# EAGLE schematic ESP32 Display 4.3 inch V1.2 (EAGLE 9.5.1)
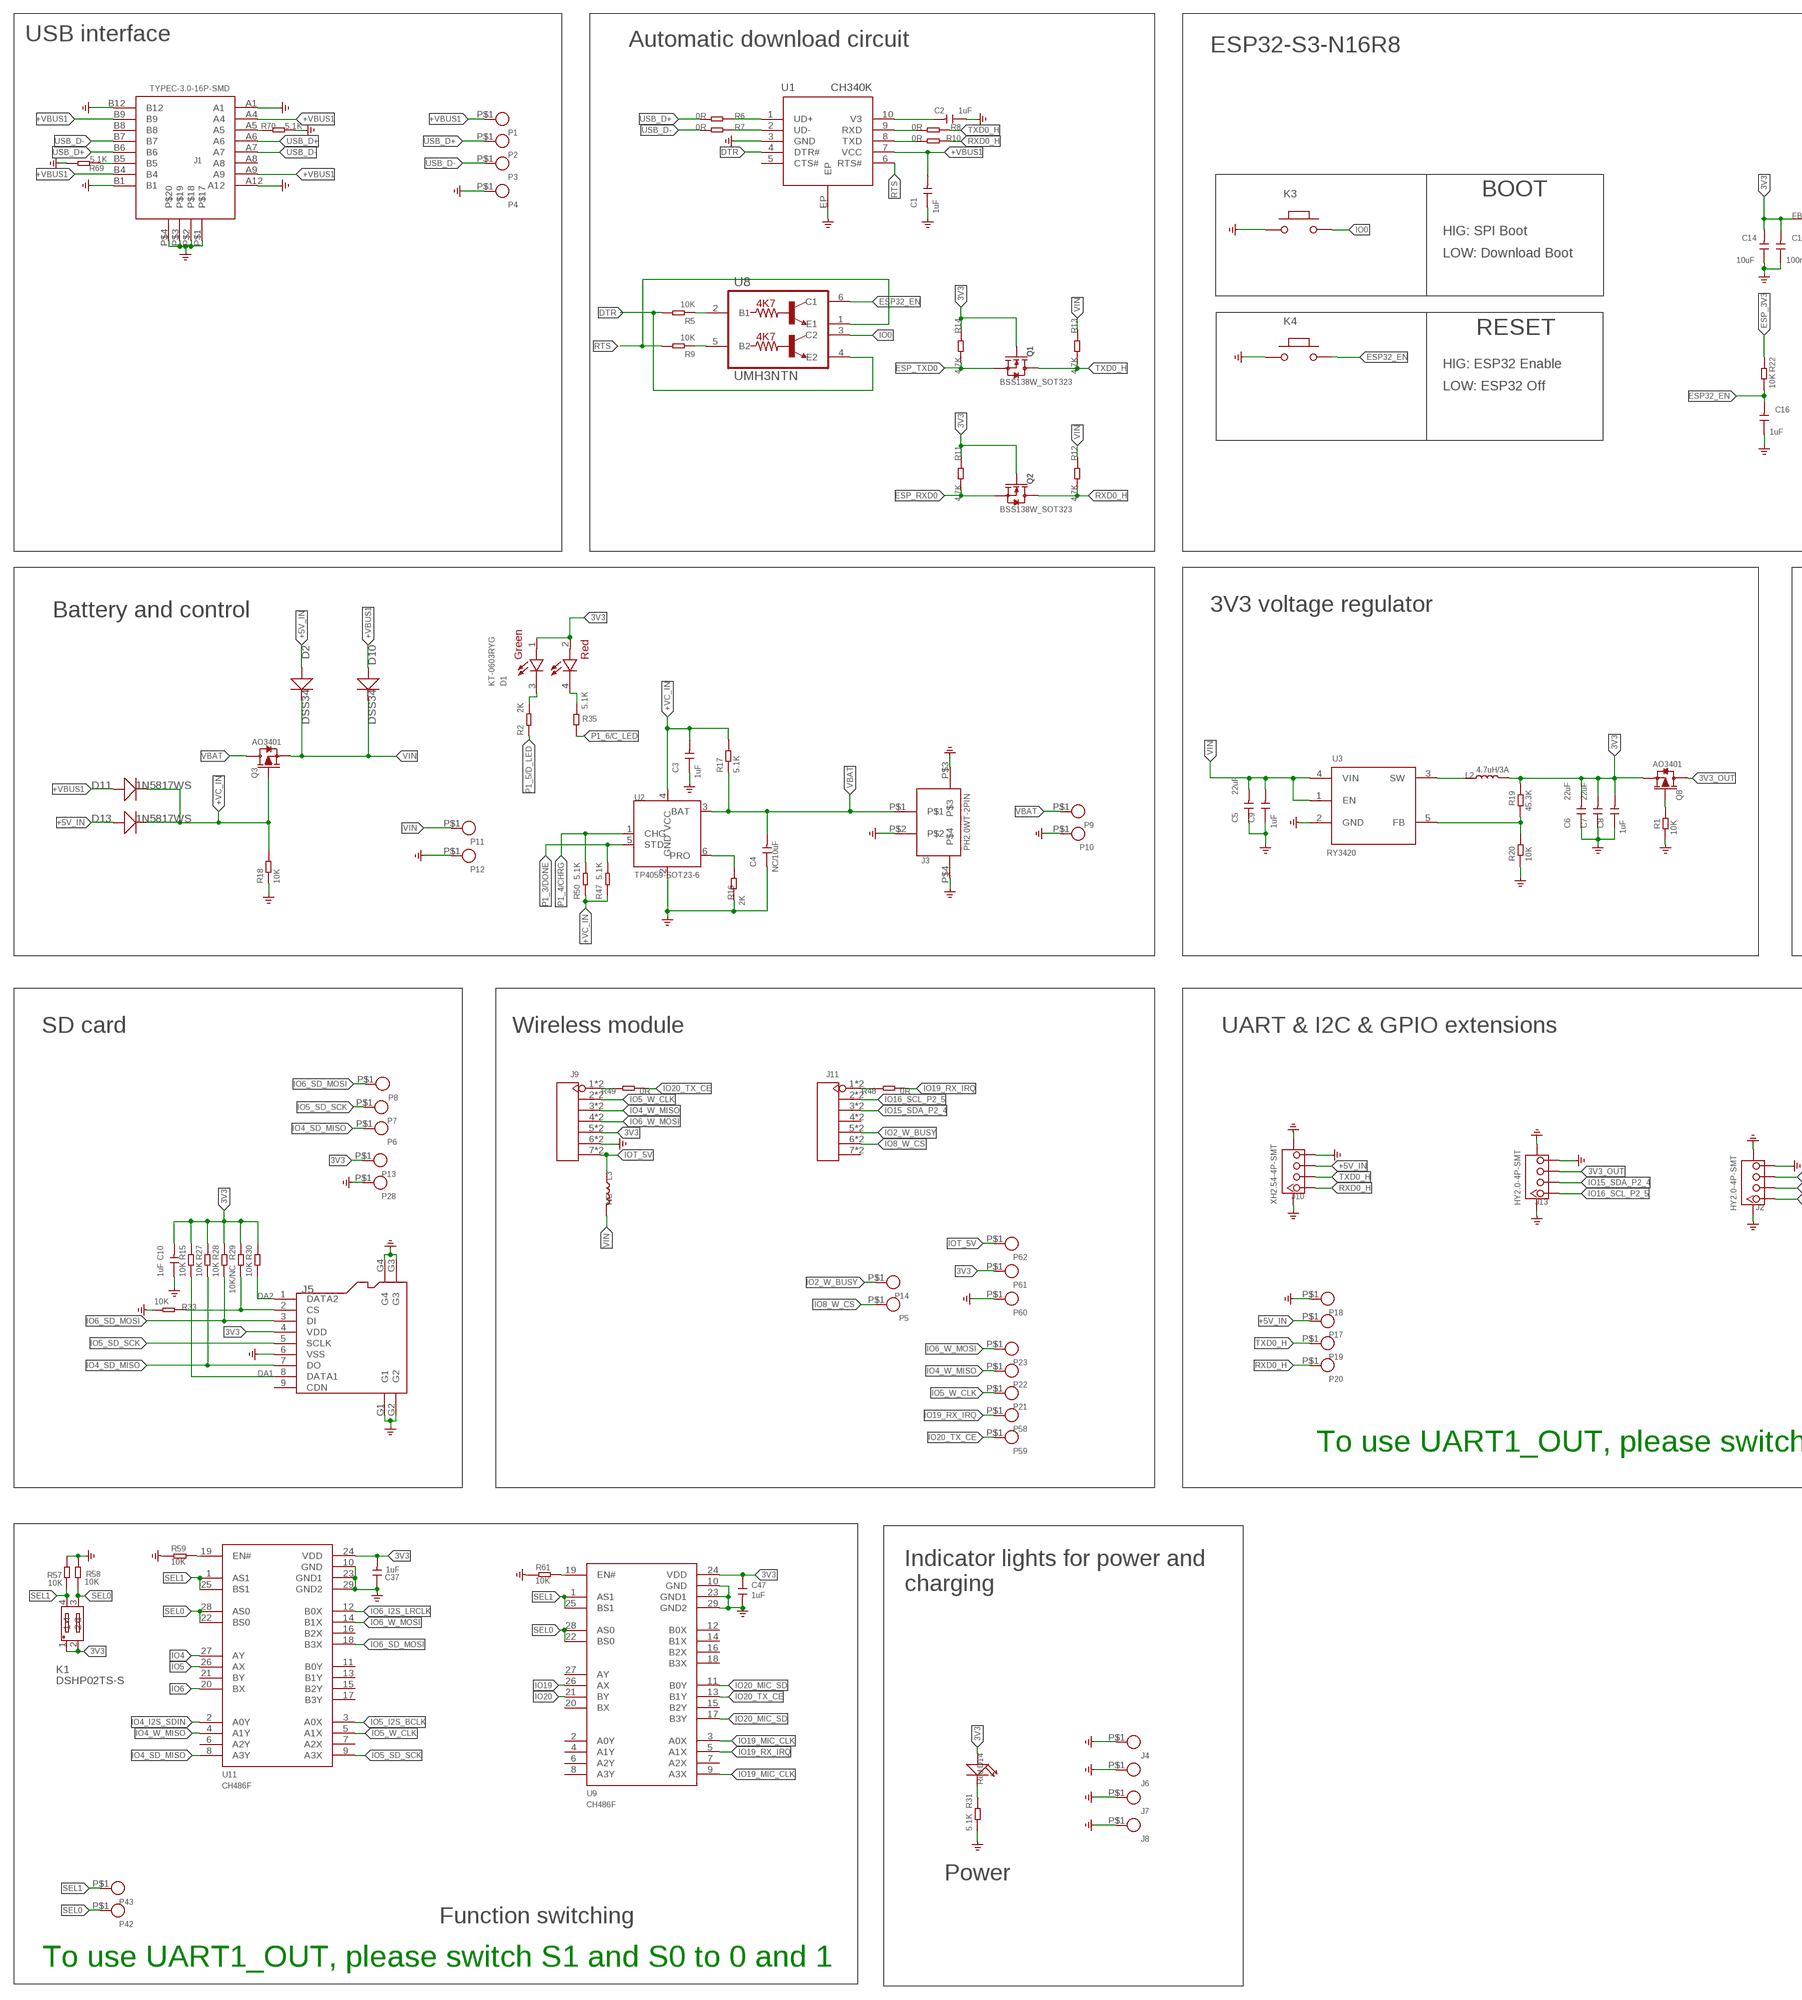
[diagram p0: schematic, sheet 1, part 1 of 2]
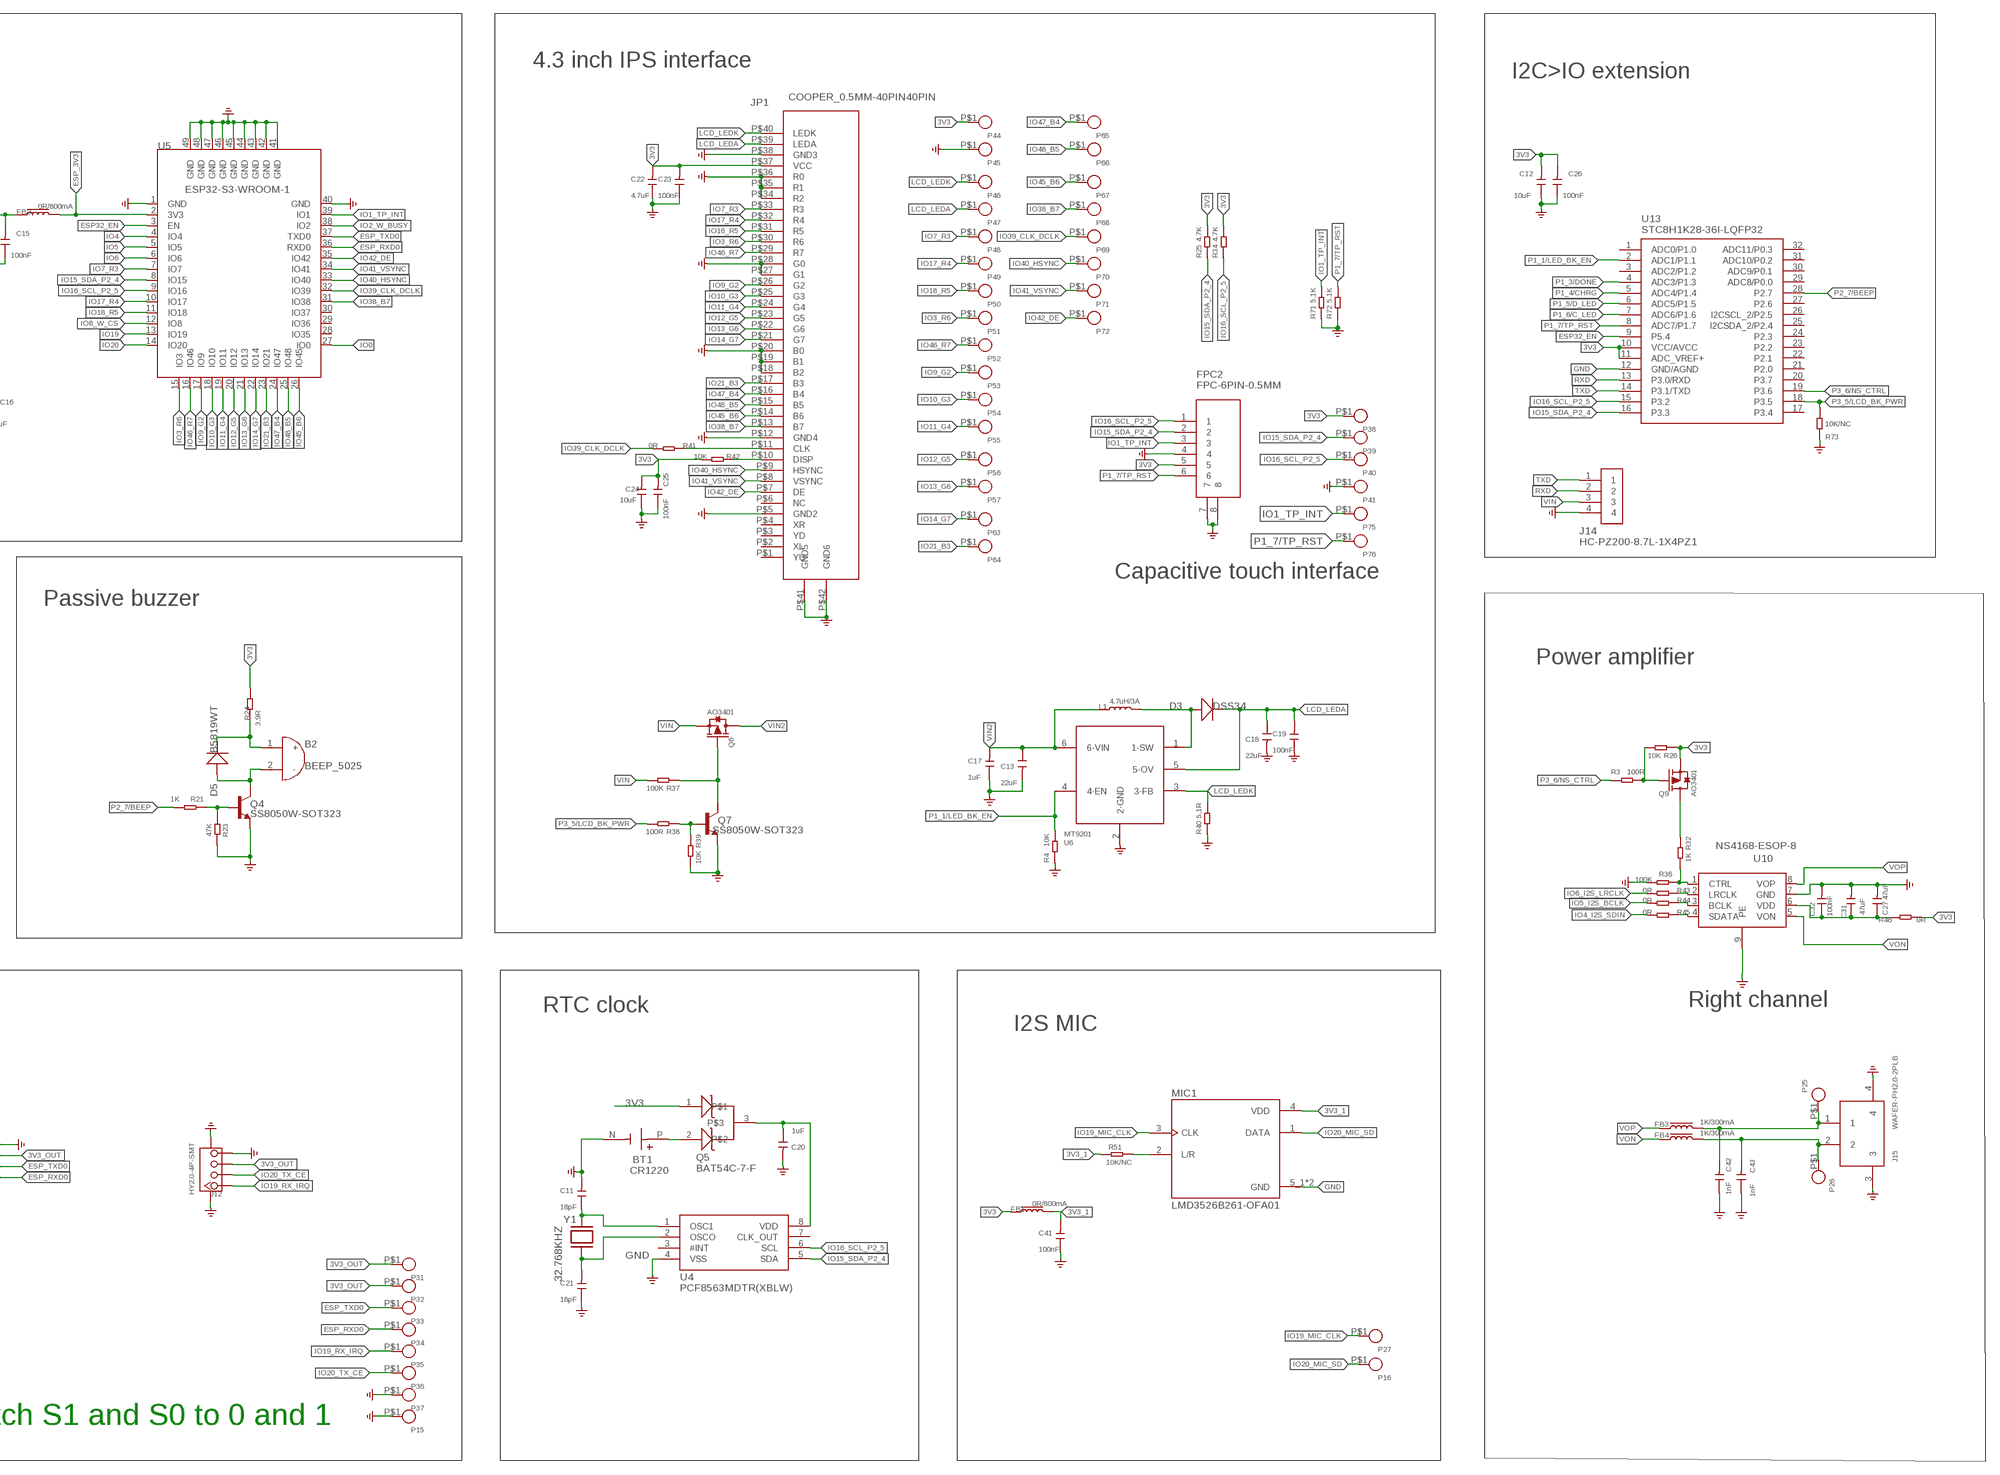
[diagram p1: schematic, sheet 1, part 2 of 2]

## Parts
B2  BEEP_5025  [BEEP_5025]
BT1  CR1220  [CR1220]
C1  1uF  CAP  [C0603]
C2  1uF  CAP  [C0603]
C3  1uF  CAP  [C0603]
C4  NC/10uF  CAP  [C0603]
C5  22uF  CAPC0805  [C0805]
C6  22uF  CAPC0805  [C0805]
C7  22uF  CAPC0805  [C0805]
C8  1uF  CAP  [C0603]
C9  1uF  CAP  [C0603]
C10  1uF  CAP  [C0603]
C11  18pF  CAP  [C0603]
C12  10uF  CAP  [C0603]
C13  22uF  CAPC0805  [C0805]
C14  10uF  CAP  [C0603]
C15  100nF  CAP  [C0603]
C16  1uF  CAP  [C0603]
C17  1uF  CAP  [C0603]
C18  22uF  CAPC0805  [C0805]
C19  100nF  CAP  [C0603]
C20  1uF  CAP  [C0603]
C21  18pF  CAP  [C0603]
C22  4.7uF  CAP  [C0603]
C23  100nF  CAP  [C0603]
C24  10uF  CAP  [C0603]
C25  100nF  CAP  [C0603]
C26  100nF  CAP  [C0603]
C27  47uF  CAPC0805  [C0805]
C31  47uF  CAPC0805  [C0805]
C32  100nF  CAP  [C0603]
C37  1uF  CAP  [C0603]
C41  100nF  CAP  [C0603]
C42  1nF  CAP  [C0603]
C43  1nF  CAP  [C0603]
C47  1uF  CAP  [C0603]
D1  KT-0603RYG  [LED_KT-0603RYG]
D2  DSS34  DIODE  [D_SOD123FL]
D3  DSS34  DIODE  [D_SOD123FL]
D5  B5819WT  DIODE0603  [D_SOD523]
D10  DSS34  DIODE  [D_SOD123FL]
D11  1N5817WS  DIODE0805  [D_SOD323]
D13  1N5817WS  DIODE0805  [D_SOD323]
D14  Red  LED-SMT0603  [LED0603]
FB1  0R/800mA  FBL0603  [L0603]
FB2  0R/800mA  FBL0603  [L0603]
FB3  1K/300mA  FBL0603  [L0603]
FB4  1K/300mA  FBL0603  [L0603]
FPC2  FPC-6PIN-0.5MM  [FPC-6PIN-0.5MM]
J1  TYPEC-3.0-16P-SMD  [USB-3.0TYPEC-SMD]
J2  HY2.0-4P-SMT  CONNECTOR_TWIG-4P-2.0-SMD-FEMALE-REINFORCEDD  [CONNECTOR_4P-SMD-2.0]
J3  PH2.0WT-2PIN  [PH2.0WT-2PIN]
J4  THO-M3.25MM-HOLE  [THO-M3.2*5MM-HOLE]
J5  HOLDER-MICROSD-9P  [9P-SMD-W/-RING]
J6  THO-M3.25MM-HOLE  [THO-M3.2*5MM-HOLE]
J7  THO-M3.25MM-HOLE  [THO-M3.2*5MM-HOLE]
J8  THO-M3.25MM-HOLE  [THO-M3.2*5MM-HOLE]
J9  HEADER-7P-18.28X2.5  [H7-2.54-18.28X2.5X5MM]
J10  XH2.54-4P-SMT  [XH2.54-4P-SMD]
J11  HEADER-7P-18.28X2.5  [H7-2.54-18.28X2.5X5MM]
J12  HY2.0-4P-SMT  CONNECTOR_TWIG-4P-2.0-SMD-FEMALE-REINFORCEDD  [CONNECTOR_4P-SMD-2.0]
J13  HY2.0-4P-SMT  CONNECTOR_TWIG-4P-2.0-SMD-FEMALE-REINFORCEDD  [CONNECTOR_4P-SMD-2.0]
J14  HC-PZ200-8.7L-1X4PZ1  [TEST-PIN-4-2.0MM]
J15  WAFER-PH2.0-2PLB  [CONN-TH_2P-P2.00_XUNPU_WAFER-PH2.0-2PLB]
JP1  COOPER_0.5MM-40PIN40PIN  [COOPER_0.5MM*40P]
K1  DSHP02TS-S  [SW-SMD_DSHP02TS-S_1]
K3  BUTTON  PB157  [157SW]
K4  BUTTON  PB157  [157SW]
L1  4.7uH/3A  LL0420  [L0420]
L2  4.7uH/3A  LL0420  [L0420]
L3  NC  L0603  [L0603]
MIC1  LMD3526B261-OFA01  LMD3526B261-OFA03  [MIC-SMD_5P-L3.5-W2.7-P1.67]
P1  TEST_PADPAD-1.5MM  [TEST_PAD-1.5MM]
P2  TEST_PADPAD-1.5MM  [TEST_PAD-1.5MM]
P3  TEST_PADPAD-1.5MM  [TEST_PAD-1.5MM]
P4  TEST_PADPAD-1.5MM  [TEST_PAD-1.5MM]
P5  TEST_PADPAD-1.5MM  [TEST_PAD-1.5MM]
P6  TEST_PADPAD-1.5MM  [TEST_PAD-1.5MM]
P7  TEST_PADPAD-1.5MM  [TEST_PAD-1.5MM]
P8  TEST_PADPAD-1.5MM  [TEST_PAD-1.5MM]
P9  TEST_PADPAD-1.5MM  [TEST_PAD-1.5MM]
P10  TEST_PADPAD-1.5MM  [TEST_PAD-1.5MM]
P11  TEST_PADPAD-1.5MM  [TEST_PAD-1.5MM]
P12  TEST_PADPAD-1.5MM  [TEST_PAD-1.5MM]
P13  TEST_PADPAD-1.5MM  [TEST_PAD-1.5MM]
P14  TEST_PADPAD-1.5MM  [TEST_PAD-1.5MM]
P15  TEST_PADPAD-1.5MM  [TEST_PAD-1.5MM]
P16  TEST_PADPAD-1.5MM  [TEST_PAD-1.5MM]
P17  TEST_PADPAD-1.5MM  [TEST_PAD-1.5MM]
P18  TEST_PADPAD-1.5MM  [TEST_PAD-1.5MM]
P19  TEST_PADPAD-1.5MM  [TEST_PAD-1.5MM]
P20  TEST_PADPAD-1.5MM  [TEST_PAD-1.5MM]
P21  TEST_PADPAD-1.5MM  [TEST_PAD-1.5MM]
P22  TEST_PADPAD-1.5MM  [TEST_PAD-1.5MM]
P23  TEST_PADPAD-1.5MM  [TEST_PAD-1.5MM]
P25  TEST_PADPAD-1.5MM  [TEST_PAD-1.5MM]
P26  TEST_PADPAD-1.5MM  [TEST_PAD-1.5MM]
P27  TEST_PADPAD-1.5MM  [TEST_PAD-1.5MM]
P28  TEST_PADPAD-1.5MM  [TEST_PAD-1.5MM]
P31  TEST_PADPAD-1.5MM  [TEST_PAD-1.5MM]
P32  TEST_PADPAD-1.5MM  [TEST_PAD-1.5MM]
P33  TEST_PADPAD-1.5MM  [TEST_PAD-1.5MM]
P34  TEST_PADPAD-1.5MM  [TEST_PAD-1.5MM]
P35  TEST_PADPAD-1.5MM  [TEST_PAD-1.5MM]
P36  TEST_PADPAD-1.5MM  [TEST_PAD-1.5MM]
P37  TEST_PADPAD-1.5MM  [TEST_PAD-1.5MM]
P38  TEST_PADPAD-1.5MM  [TEST_PAD-1.5MM]
P39  TEST_PADPAD-1.5MM  [TEST_PAD-1.5MM]
P40  TEST_PADPAD-1.5MM  [TEST_PAD-1.5MM]
P41  TEST_PADPAD-1.5MM  [TEST_PAD-1.5MM]
P42  TEST_PADPAD-1.5MM  [TEST_PAD-1.5MM]
P43  TEST_PADPAD-1.5MM  [TEST_PAD-1.5MM]
P44  TEST_PADPAD-1.5MM  [TEST_PAD-1.5MM]
P45  TEST_PADPAD-1.5MM  [TEST_PAD-1.5MM]
P46  TEST_PADPAD-1.5MM  [TEST_PAD-1.5MM]
P47  TEST_PADPAD-1.5MM  [TEST_PAD-1.5MM]
P48  TEST_PADPAD-1.5MM  [TEST_PAD-1.5MM]
P49  TEST_PADPAD-1.5MM  [TEST_PAD-1.5MM]
P50  TEST_PADPAD-1.5MM  [TEST_PAD-1.5MM]
P51  TEST_PADPAD-1.5MM  [TEST_PAD-1.5MM]
P52  TEST_PADPAD-1.5MM  [TEST_PAD-1.5MM]
P53  TEST_PADPAD-1.5MM  [TEST_PAD-1.5MM]
P54  TEST_PADPAD-1.5MM  [TEST_PAD-1.5MM]
P55  TEST_PADPAD-1.5MM  [TEST_PAD-1.5MM]
P56  TEST_PADPAD-1.5MM  [TEST_PAD-1.5MM]
P57  TEST_PADPAD-1.5MM  [TEST_PAD-1.5MM]
P58  TEST_PADPAD-1.5MM  [TEST_PAD-1.5MM]
P59  TEST_PADPAD-1.5MM  [TEST_PAD-1.5MM]
P60  TEST_PADPAD-1.5MM  [TEST_PAD-1.5MM]
P61  TEST_PADPAD-1.5MM  [TEST_PAD-1.5MM]
P62  TEST_PADPAD-1.5MM  [TEST_PAD-1.5MM]
P63  TEST_PADPAD-1.5MM  [TEST_PAD-1.5MM]
P64  TEST_PADPAD-1.5MM  [TEST_PAD-1.5MM]
P65  TEST_PADPAD-1.5MM  [TEST_PAD-1.5MM]
P66  TEST_PADPAD-1.5MM  [TEST_PAD-1.5MM]
P67  TEST_PADPAD-1.5MM  [TEST_PAD-1.5MM]
P68  TEST_PADPAD-1.5MM  [TEST_PAD-1.5MM]
P69  TEST_PADPAD-1.5MM  [TEST_PAD-1.5MM]
P70  TEST_PADPAD-1.5MM  [TEST_PAD-1.5MM]
P71  TEST_PADPAD-1.5MM  [TEST_PAD-1.5MM]
P72  TEST_PADPAD-1.5MM  [TEST_PAD-1.5MM]
P75  TEST_PADPAD-1.5MM  [TEST_PAD-1.5MM]
P76  TEST_PADPAD-1.5MM  [TEST_PAD-1.5MM]
Q1  BSS138W_SOT323  MOSFET-NSI1304BDL  [MOS_SOT323]
Q2  BSS138W_SOT323  MOSFET-NSI1304BDL  [MOS_SOT323]
Q3  AO3401  MOSFET-PSOT23  [PMOS_SOT23]
Q4  SS8050W-SOT323  TRANS_NPN  [MOS_SOT323]
Q5  BAT54C-7-F  [SOT-23]
Q6  AO3401  MOSFET-PSOT23  [PMOS_SOT23]
Q7  SS8050W-SOT323  TRANS_NPN  [MOS_SOT323]
Q8  AO3401  MOSFET-PSOT23  [PMOS_SOT23]
Q9  AO3401  MOSFET-PSOT23  [PMOS_SOT23]
R1  10K  RES-0603  [R0603-SP]
R2  2K  RES-0603  [R0603-SP]
R3  100R  RES-0603  [R0603-SP]
R4  10K  RES-0603  [R0603-SP]
R5  10K  RES-0603  [R0603-SP]
R6  0R  RES-0603  [R0603-SP]
R7  0R  RES-0603  [R0603-SP]
R8  0R  RES-0603  [R0603-SP]
R9  10K  RES-0603  [R0603-SP]
R10  0R  RES-0603  [R0603-SP]
R11  4.7K  RES-0603  [R0603-SP]
R12  4.7K  RES-0603  [R0603-SP]
R13  4.7K  RES-0603  [R0603-SP]
R14  4.7K  RES-0603  [R0603-SP]
R15  10K  RES-0603  [R0603-SP]
R16  2K  RES-0603  [R0603-SP]
R17  5.1K  RES-0603  [R0603-SP]
R18  10K  RES-0603  [R0603-SP]
R19  45.3K  RES-0603  [R0603-SP]
R20  10K  RES-0603  [R0603-SP]
R21  1K  RES-0603  [R0603-SP]
R22  10K  RES-0603  [R0603-SP]
R23  47K  RES-0603  [R0603-SP]
R24  3.9R  RES-0603  [R0603-SP]
R25  4.7K  RES-0603  [R0603-SP]
R26  10K  RES-0603  [R0603-SP]
R27  10K  RES-0603  [R0603-SP]
R28  10K  RES-0603  [R0603-SP]
R29  10K/NC  RES-0603  [R0603-SP]
R30  10K  RES-0603  [R0603-SP]
R31  5.1K  RES-0603  [R0603-SP]
R32  1K  RES-0603  [R0603-SP]
R33  10K  RES-0603  [R0603-SP]
R34  4.7K  RES-0603  [R0603-SP]
R35  5.1K  RES-0603  [R0603-SP]
R36  100K  RES-0603  [R0603-SP]
R37  100K  RES-0603  [R0603-SP]
R38  100R  RES-0603  [R0603-SP]
R39  10K  RES-0603  [R0603-SP]
R40  5.1R  RES-0603  [R0603-SP]
R41  0R  RES-0603  [R0603-SP]
R42  10K  RES-0603  [R0603-SP]
R43  0R  RES-0603  [R0603-SP]
R44  0R  RES-0603  [R0603-SP]
R45  0R  RES-0603  [R0603-SP]
R46  0R  RES-0603  [R0603-SP]
R47  5.1K  RES-0603  [R0603-SP]
R48  0R  RES-0603  [R0603-SP]
R49  0R  RES-0603  [R0603-SP]
R50  5.1K  RES-0603  [R0603-SP]
R51  10K/NC  RES-0603  [R0603-SP]
R57  10K  RES-0603  [R0603-SP]
R58  10K  RES-0603  [R0603-SP]
R59  10K  RES-0603  [R0603-SP]
R61  10K  RES-0603  [R0603-SP]
R69  5.1K  RES-0603  [R0603-SP]
R70  5.1K  RES-0603  [R0603-SP]
R71  5.1K  RES-0603  [R0603-SP]
R72  5.1K  RES-0603  [R0603-SP]
R73  10K/NC  RES-0603  [R0603-SP]
U1  CH340K  [ESOP-10-EP-150MIL]
U2  TP4059-SOT23-6  [SOT23-6L]
U3  RY3420  HM3416H  [IC_SOT23-5]
U4  PCF8563MDTR(XBLW)  BM8563EMA  [MSOP-8]
U5  ESP32-S3-WROOM-1  [ESP32-S3-WROOM-1-SMD41]
U6  MT9201  COOPER_MT9201  [COOPER_SOT23-6]
U8  UMH3NTN  [SOP65P210X100-6N]
U9  CH486F  [QFN-28_L4.0-W4.0-P0.40-BL-EP2.8]
U10  NS4168-ESOP-8  [NS4168-ESOP-8]
U11  CH486F  [QFN-28_L4.0-W4.0-P0.40-BL-EP2.8]
U13  STC8H1K28-36I-LQFP32  [QFP80P900X900X165-32N]
Y1  32.768KHZ  [SMD3215-2P]

## Nets
3V3: C6.2 C7.2 C8.2 C10.2 C12.2 C14.2 C15.2 C22.2 C23.2 C24.2 C25.2 C26.2 C37.2 C47.1 D1.1 D1.2 D14.+ FB1.1 FB2.1 FPC2.5 J5.4(VDD) J9.5 J9.5-5 JP1.P$37(VCC) K1.1 K1.2 L2.2 P13.P$1 P38.P$1 P44.P$1 P61.P$1 Q1.1(G) Q2.1(G) Q5.1 Q8.2(S) Q9.2(S) R11.1 R14.1 R15.2 R19.2 R24.2 R25.2 R26.1 R27.2 R28.2 R29.2 R30.2 R34.2 R42.2 R46.2 U9.24(VDD) U11.24(VDD) U13.10(VCC/AVCC) U13.11(ADC_VREF+)
3V3$: C2.2 U1.10(V3)
3V3_1: C41.2 FB1.2 MIC1.4(VDD) R51.2
3V3_NS_CTRL: Q9.3(D) R32.1
3V3_OUT: J2.3 J12.3 J13.3 P31.P$1 P32.P$1 Q8.3(D)
+5V_IN: D2.+ D13.+ J10.3 P17.P$1
+VBUS1: C1.2 D10.+ D11.+ J1.A4 J1.A9 J1.B4 J1.B9 P1.P$1 U1.7(VCC)
+VC_IN: C3.2 D11.- D13.- Q3.1(G) R17.2 R18.2 R47.2 R50.2 U2.4(VCC)
DA1: J5.8(DATA1) R15.1
DA2: J5.1(DATA2) R30.1
DTR: R5.2 U1.4(DTR#) U8.4(E2)
ESP32_EN: C16.2 K4.2 R22.2 U5.3(EN) U8.6(C1) U13.9(P5.4)
ESP_3V3: FB2.2 R22.1 U5.2(3V3)
ESP_RXD0: J2.1 P34.P$1 Q2.2(S) R11.2 U5.36(RXD0)
ESP_TXD0: J2.2 P33.P$1 Q1.2(S) R14.2 U5.37(TXD0)
GND: BT1.N(-) C1.1 C2.1 C3.1 C4.1 C5.1 C6.1 C7.1 C8.1 C9.1 C10.1 C11.2 C12.1 C13.2 C14.1 C15.1 C16.1 C17.1 C18.2 C19.1 C20.2 C21.1 C22.1 C23.1 C24.1 C25.1 C26.1 C27.2 C31.2 C32.2 C37.1 C41.1 C42.1 C43.1 C47.2 FPC2.4 FPC2.7 FPC2.8 J1.A1 J1.A12 J1.B1 J1.B12 J1.P$1 J1.P$2 J1.P$3 J1.P$4 J2.4 J2.SS1 J2.SS2 J3.P$2 J3.P$3 J3.P$4 J4.P$1 J5.6(VSS) J5.G1 J5.G2 J5.G3 J5.G4 J6.P$1 J7.P$1 J8.P$1 J9.6 J9.6-6 J10.4 J10.5(SS1) J10.6(SS2) J12.4 J12.SS1 J12.SS2 J13.4 J13.SS1 J13.SS2 J14.4 J15.3 J15.4 JP1.P$5(GND2) JP1.P$12(GND4) JP1.P$18(B2) JP1.P$19(B1) JP1.P$20(B0) JP1.P$27(G1) JP1.P$28(G0) JP1.P$34(R2) JP1.P$35(R1) JP1.P$36(R0) JP1.P$38(GND3) JP1.P$41(GND5) JP1.P$42(GND6) K3.1 K4.1 MIC1.5_1(GND) MIC1.5_2(GND) P4.P$1 P10.P$1 P12.P$1 P15.P$1 P18.P$1 P28.P$1 P37.P$1 P41.P$1 P45.P$1 P60.P$1 Q4.2(E) Q7.2(E) R1.1 R4.1 R16.1 R18.1 R20.1 R23.2 R31.1 R33.2 R36.2 R39.2 R40.1 R57.2 R58.2 R59.2 R61.2 R69.1 R70.2 R71.1 R72.1 R73.1 U1.3(GND) U1.EP U2.2(GND) U3.2(GND) U4.4(VSS) U5.1(GND) U5.40(GND) U5.41(GND) U5.42(GND) U5.43(GND) U5.44(GND) U5.45(GND) U5.46(GND) U5.47(GND) U5.48(GND) U5.49(GND) U6.2(2-GND) U9.10(GND) U9.23(GND1) U9.29(GND2) U10.7(GND) U10.9(PE) U11.10(GND) U11.23(GND1) U11.29(GND2) U13.12(GND/AGND)
IO0: K3.2 U5.27(IO0) U8.3(C2)
IO1_TP_INT: FPC2.3 P75.P$1 R71.2 U5.39(IO1)
IO2_W_BUSY: J11.5 J11.5-5 P14.P$1 U5.38(IO2)
IO3_R6: JP1.P$30(R6) P51.P$1 U5.15(IO3)
IO4: U5.4(IO4) U11.27(AY)
IO4_I2S_SDIN: R45.2 U11.2(A0Y)
IO4_SD_MISO: J5.7(DO) P6.P$1 R27.1 U11.8(A3Y)
IO4_W_MISO: J9.3 J9.3-3 P22.P$1 U11.4(A1Y)
IO5: U5.5(IO5) U11.26(AX)
IO5_I2S_BCLK: R44.2 U11.3(A0X)
IO5_SD_SCK: J5.5(SCLK) P7.P$1 U11.9(A3X)
IO5_W_CLK: J9.2 J9.2-2 P21.P$1 U11.5(A1X)
IO6: U5.6(IO6) U11.20(BX)
IO6_I2S_LRCLK: R43.2 U11.12(B0X)
IO6_SD_MOSI: J5.3(DI) P8.P$1 R28.1 U11.18(B3X)
IO6_W_MOSI: J9.4 J9.4-4 P23.P$1 U11.14(B1X)
IO7_R3: JP1.P$33(R3) P48.P$1 U5.7(IO7)
IO8_W_CS: J11.6 J11.6-6 P5.P$1 U5.12(IO8)
IO9_G2: JP1.P$26(G2) P53.P$1 U5.17(IO9)
IO10_G3: JP1.P$25(G3) P54.P$1 U5.18(IO10)
IO11_G4: JP1.P$24(G4) P55.P$1 U5.19(IO11)
IO12_G5: JP1.P$23(G5) P56.P$1 U5.20(IO12)
IO13_G6: JP1.P$22(G6) P57.P$1 U5.21(IO13)
IO14_G7: JP1.P$21(G7) P63.P$1 U5.22(IO14)
IO15_SDA_P2_4: FPC2.2 J11.3 J11.3-3 J13.2 P39.P$1 R25.1 U4.5(SDA) U5.8(IO15) U13.16(P3.3)
IO16_SCL_P2_5: FPC2.1 J11.2 J11.2-2 J13.1 P40.P$1 R34.1 U4.6(SCL) U5.9(IO16) U13.15(P3.2)
IO17_R4: JP1.P$32(R4) P49.P$1 U5.10(IO17)
IO18_R5: JP1.P$31(R5) P50.P$1 U5.11(IO18)
IO19: U5.13(IO19) U9.26(AX)
IO19_MIC_CLK: MIC1.3(CLK) P27.P$1 U9.3(A0X) U9.9(A3X)
IO19_RX_IRQ: J12.1 P35.P$1 P58.P$1 R48.2 U9.5(A1X)
IO20: U5.14(IO20) U9.21(BY)
IO20_MIC_SD: MIC1.1(DATA) P16.P$1 U9.11(B0Y) U9.17(B3Y)
IO20_TX_CE: J12.2 P36.P$1 P59.P$1 R49.2 U9.13(B1Y)
IO21_B3: JP1.P$17(B3) P64.P$1 U5.23(IO21)
IO38_B7: JP1.P$13(B7) P68.P$1 U5.31(IO38)
IO39_CLK_DCLK: P69.P$1 R41.2 U5.32(IO39)
IO40_HSYNC: JP1.P$9(HSYNC) P70.P$1 U5.33(IO40)
IO41_VSYNC: JP1.P$8(VSYNC) P71.P$1 U5.34(IO41)
IO42_DE: JP1.P$7(DE) P72.P$1 U5.35(IO42)
IO45_B6: JP1.P$14(B6) P67.P$1 U5.26(IO45)
IO46_R7: JP1.P$29(R7) P52.P$1 U5.16(IO46)
IO47_B4: JP1.P$16(B4) P65.P$1 U5.24(IO47)
IO48_B5: JP1.P$15(B5) P66.P$1 U5.25(IO48)
IOT_5V: J9.7 J9.7-7 L3.1 P62.P$1
LCD_LEDA: C18.1 C19.2 D3.- JP1.P$39(LEDA) P47.P$1 U6.5(5-OV)
LCD_LEDK: JP1.P$40(LEDK) P46.P$1 R40.2 U6.3(3-FB)
N$1: Q8.1(G) R1.2
N$2: D1.3 R2.1
N$3: D1.4 R35.1
N$4: D14.- R31.2
N$5: R6.1 U1.1(UD+)
N$6: R7.1 U1.2(UD-)
N$7: R5.1 U8.2(B1)
N$8: R9.1 U8.5(B2)
N$9: Q9.1(G) R3.2 R26.2
N$10: R8.2 U1.9(RXD)
N$11: R10.2 U1.8(TXD)
N$12: R16.2 U2.6(PRO)
N$13: L2.1 U3.3(SW)
N$14: R19.1 R20.2 U3.5(FB)
N$15: Q4.1(B) R21.1 R23.1
N$16: B2.2(-) D5.+ Q4.3(C)
N$17: B2.1(+) D5.- R24.1
N$18: BT1.P(+) Q5.2
N$19: R32.2 R36.1 U10.1(CTRL)
N$20: MIC1.2(L/R) R51.1
N$22: D3.+ L1.2 U6.1(1-SW)
N$23: J9.1 J9.1-1 R49.1
N$24: J11.1 J11.1-1 R48.1
N$25: C20.1 Q5.3 U4.8(VDD)
N$26: C21.2 U4.2(OSCO) Y1.2
N$28: R43.1 U10.2(LRCLK)
N$29: Q6.1(G) Q7.3(C) R37.1
N$30: C11.1 U4.1(OSC1) Y1.1
N$31: R44.1 U10.3(BCLK)
N$32: Q7.1(B) R38.1 R39.1
N$33: R45.1 U10.4(SDATA)
N$34: J1.B5 R69.2
N$35: R61.1 U9.19(EN#)
N$37: C27.1 C31.1 C32.1 R46.1 U10.6(VDD)
N$38: R59.1 U11.19(EN#)
N$40: J1.A5 R70.1
N$54: JP1.P$11(CLK) R41.1
N$55: JP1.P$10(DISP) R42.1
P1_1/LED_BK_EN: R4.2 U6.4(4-EN) U13.2(ADC1/P1.1)
P1_3/DONE: R47.1 U2.5(STD) U13.4(ADC3/P1.3)
P1_4/CHRG: R50.1 U2.1(CHG) U13.5(ADC4/P1.4)
P1_5/D_LED: R2.2 U13.6(ADC5/P1.5)
P1_6/C_LED: R35.2 U13.7(ADC6/P1.6)
P1_7/TP_RST: FPC2.6 P76.P$1 R72.2 U13.8(ADC7/P1.7)
P2_7/BEEP: R21.2 U13.28(P2.7)
P3_5/LCD_BK_PWR: R38.2 R73.2 U13.18(P3.5)
P3_6/NS_CTRL: R3.1 U13.19(P3.6)
ROUT+: C42.2 FB3.2 J15.1 P25.P$1
ROUT-: C43.2 FB4.2 J15.2 P26.P$1
RTS: R9.2 U1.6(RTS#) U8.1(E1)
RXD: J14.2 U13.13(P3.0/RXD)
RXD0_H: J10.1 P20.P$1 Q2.3(D) R10.1 R12.2
SDCS: J5.2(CS) R29.1 R33.1
SEL0: K1.3 P42.P$1 R58.1 U9.22(BS0) U9.28(AS0) U11.22(BS0) U11.28(AS0)
SEL1: K1.4 P43.P$1 R57.1 U9.1(AS1) U9.25(BS1) U11.1(AS1) U11.25(BS1)
TXD: J14.1 U13.14(P3.1/TXD)
TXD0_H: J10.2 P19.P$1 Q1.3(D) R8.1 R13.2
USB_D+: J1.A6 J1.B6 P2.P$1 R6.2
USB_D-: J1.A7 J1.B7 P3.P$1 R7.2
VBAT: C4.2 J3.P$1 P9.P$1 Q3.3(D) R17.1 U2.3(BAT)
VIN: C5.2 C9.2 D2.- D10.- J14.3 L3.2 P11.P$1 Q3.2(S) Q6.2(S) R12.1 R13.1 R37.2 U3.1(EN) U3.4(VIN)
VIN2: C13.1 C17.2 L1.1 Q6.3(D) U6.6(6-VIN)
VON: FB4.1 U10.5(VON)
VOP: FB3.1 U10.8(VOP)
Unconnected: J1.A8 J1.B8 J5.9(CDN) J11.4 J11.4-4 J11.7 J11.7-7 JP1.P$1(YU) JP1.P$2(XL) JP1.P$3(YD) JP1.P$4(XR) JP1.P$6(NC) U1.5(CTS#) U4.3(#INT) U4.7(CLK_OUT) U5.28(IO35) U5.29(IO36) U5.30(IO37) U9.2(A0Y) U9.4(A1Y) U9.6(A2Y) U9.7(A2X) U9.8(A3Y) U9.12(B0X) U9.14(B1X) U9.15(B2Y) U9.16(B2X) U9.18(B3X) U9.20(BX) U9.27(AY) U11.6(A2Y) U11.7(A2X) U11.11(B0Y) U11.13(B1Y) U11.15(B2Y) U11.16(B2X) U11.17(B3Y) U11.21(BY) U13.1(ADC0/P1.0) U13.3(ADC2/P1.2) U13.17(P3.4) U13.20(P3.7) U13.21(P2.0) U13.22(P2.1) U13.23(P2.2) U13.24(P2.3) U13.25(I2CSDA_2/P2.4) U13.26(I2CSCL_2/P2.5) U13.27(P2.6) U13.29(ADC8/P0.0) U13.30(ADC9/P0.1) U13.31(ADC10/P0.2) U13.32(ADC11/P0.3)

## Notes on the sheet
- USB interface | Automatic download circuit
- ESP32-S3-N16R8
- 4.3 inch IPS interface
- I2C>IO extension
- BOOT
- HIG: SPI Boot
- LOW: Download Boot
- RESET
- HIG: ESP32 Enable
- LOW: ESP32 Off
- Capacitive touch interface
- Battery and control | 3V3 voltage regulator | Passive buzzer
- Power amplifier
- RTC clock | Right channel
- SD card | Wireless module | UART & I2C & GPIO extensions
- I2S MIC
- To use UART1_OUT, please switch S1 and S0 to 0 and 1
- Indicator lights for power and 
  charging
- Power
- Function switching
- To use UART1_OUT, please switch S1 and S0 to 0 and 1

## Library data of the parts
B2 = CrowPanel_Advance_HMI:BEEP_5025
BT1 = CR1220:CR1220: Coin Cell Smt Horizontal Insul Check availability <https://pricing.snapeda.com/parts/S8411-45R/Harwin/view-part?ref=eda>; AVAILABILITY: In Stock; CHECK_PRICES: https://www.snapeda.com/parts/S8411-45R/Harwin+Inc./view-part/?ref=eda; DESCRIPTION: Coin Cell Battery Retainer, Horizontal SMT, for CR1220 Coin Cell Batteries, Tape & Reeled; MF: Harwin; MP: S8411-45R; PACKAGE: None; PRICE: None; PURCHASE-URL: https://www.snapeda.com/api/url_track_click_mouser/?unipart_id=424412&manufacturer=Harwin&part_name=S8411-45R&search_term=cr1220; SNAPEDA_LINK: https://www.snapeda.com/parts/S8411-45R/Harwin+Inc./view-part/?ref=snap
C1-C27 C31 C32 C37 C41-C43 C47 = CrowPanel_Advance_HMI:CAP*
D1 = KT-0603RYG:KT-0603RYG: Check availability <https://pricing.snapeda.com/parts/KT-0603R/Hubei%20KENTO%20Elec/view-part?ref=eda>
D2 D3 D5 D10 D11 D13 = CrowPanel_Advance_HMI:DIODE*
D14 = CrowPanel_Advance_HMI:LED-SMT*
FB1-FB4 = CrowPanel_Advance_HMI:FB*
FPC2 = CrowPanel_Advance_HMI:FPC-6PIN-0.5MM
J1 = CrowPanel_Advance_HMI:TYPEC-3.0-16P-SMD
J2 J12 J13 = CrowPanel_Advance_HMI:CONNECTOR_TWIG-4P-2.0-SMD-FEMALE-REINFORCE
J3 = CrowPanel_Advance_HMI:PH2.0WT-2PIN
J4 J6-J8 = CrowPanel_Advance_HMI:THO-M3.2*5MM-HOLE
J5 = CrowPanel_Advance_HMI:HOLDER-MICROSD-9P
J9 J11 = CrowPanel_Advance_HMI:HEADER-7P
J10 = CrowPanel_Advance_HMI:XH2.54-4P-SMT
J14 = Mini PC Case:HC-PZ200-8.7L-1X4PZ
J15 = CrowPanel_Advance_HMI:WAFER-PH2.0-2PLB
JP1 = CrowPanel_Advice_HMI 4.3:COOPER_0.5MM-40PIN
K1 = CrowPanel_Advance_HMI:DSHP02TS-S
K3 K4 = MySMD:PB157
L1-L3 = CrowPanel_Advance_HMI:L*
MIC1 = MMICT5838-00-012:LMD3526B261-OFA03
P1-P23 P25-P28 P31-P72 P75 P76 = CrowPanel_Advance_HMI:TEST_PAD*
Q1 Q2 = CrowPanel_Advance_HMI:MOSFET-N*: IRLL014: http://www.vishay.com/docs/91319/sihll014.pdf
Q3 Q6 Q8 Q9 = CrowPanel_Advance_HMI:MOSFET-P: IRLL014: http://www.vishay.com/docs/91319/sihll014.pdf
Q4 Q7 = CrowPanel_Advance_HMI:TRANS_NPN: NPN transistor Current controlled devices typically used to amplify current or used as a switch. BC547 - COM-08928 <http://www.sparkfun.com/products/8928> (TO-92 45V 100mA) (1.Collector 2.Base 3.Emitter) 2N3904 - COM-00521 <http://www.sparkfun.com/products/521> (TO-92 40V 200mA) (1.Emitter 2.Base 3.Collector) P2N2222A - COM-12852 <http://www.sparkfun.com/products/12852> (TO-92 40V 600mA) (1.Collector 2.Base 3.Emitter)
Q5 = BAT54C-7-F:BAT54C-7-F
R1-R51 R57-R59 R61 R69-R73 = CrowPanel_Advance_HMI:RES*
U1 = sale:CH340K
U2 = CrowPanel_Advance_HMI:TP4059-SOT23-6
U3 = CrowPanel_Advance_HMI:HM3416H
U4 = BM8563:BM8563EMA
U5 = CrowPanel_Advance_HMI:ESP32-S3-WROOM-1
U6 = CrowPanel_Advice_HMI 4.3:COOPER_MT9201
U8 = UMH3NTN:UMH3NTN: Dual NPN BJT with 4.7K Base resistor Datasheet <https://fscdn.rohm.com/en/products/databook/datasheet/discrete/transistor/digital/umh3ntn-e.pdf> BUY NOW <https://www.digikey.ca/en/products/detail/rohm-semiconductor/umh3ntn/659279> Check availability <https://pricing.snapeda.com/parts/UMH3NTN/Rohm/view-part?ref=eda>; AVAILABILITY: In Stock; CHECK_PRICES: https://www.snapeda.com/parts/UMH3NTN/Rohm/view-part/?ref=eda; DESCRIPTION: Pre-Biased Bipolar Transistor (BJT) 2 NPN - Pre-Biased (Dual) 50V 100mA 250MHz 150mW Surface Mount UMT6; MF: Rohm; MP: UMH3NTN; PACKAGE: SOT-363 Rohm; PRICE: None; PURCHASE-URL: https://www.snapeda.com/api/url_track_click_mouser/?unipart_id=355768&manufacturer=Rohm&part_name=UMH3NTN&search_term=umh3n; SNAPEDA_LINK: https://www.snapeda.com/parts/UMH3NTN/Rohm/view-part/?ref=snap
U9 U11 = CH48X:CH486F
U10 = STC_MCUSTC8G1K08A:NS4168-ESOP-8
U13 = Brian:STC8H1K28-36I-LQFP32
Y1 = Crystal:32.768KHZ: Check availability <https://pricing.snapeda.com/parts/CM7V-T1A-32.768kHz-12.5pF-100PPM-TB-QC/Micro%20Crystal/view-part?ref=eda>; AVAILABILITY: In Stock; CHECK_PRICES: https://www.snapeda.com/parts/CM7V-T1A-32.768kHz-12.5pF-100PPM-TB-QC/Micro+Crystal/view-part/?ref=eda; DESCRIPTION: Tuning Fork Crystal 32.768kHz in SMD 1.5 x 3.2 mm package; MF: Micro Crystal; MP: CM7V-T1A-32.768kHz-12.5pF-100PPM-TB-QC; PACKAGE: SMD-2 Micro Crystal; PRICE: None; PURCHASE-URL: https://www.snapeda.com/api/url_track_click_mouser/?unipart_id=4216772&manufacturer=Micro Crystal&part_name=CM7V-T1A-32.768kHz-12.5pF-100PPM-TB-QC&search_term=crystal; SNAPEDA_LINK: https://www.snapeda.com/parts/CM7V-T1A-32.768kHz-12.5pF-100PPM-TB-QC/Micro+Crystal/view-part/?ref=snap